# EasyEDA Pro project lune-v6-rev3.2.eprj

# Schematic lune-v6-rev3.2-connectors
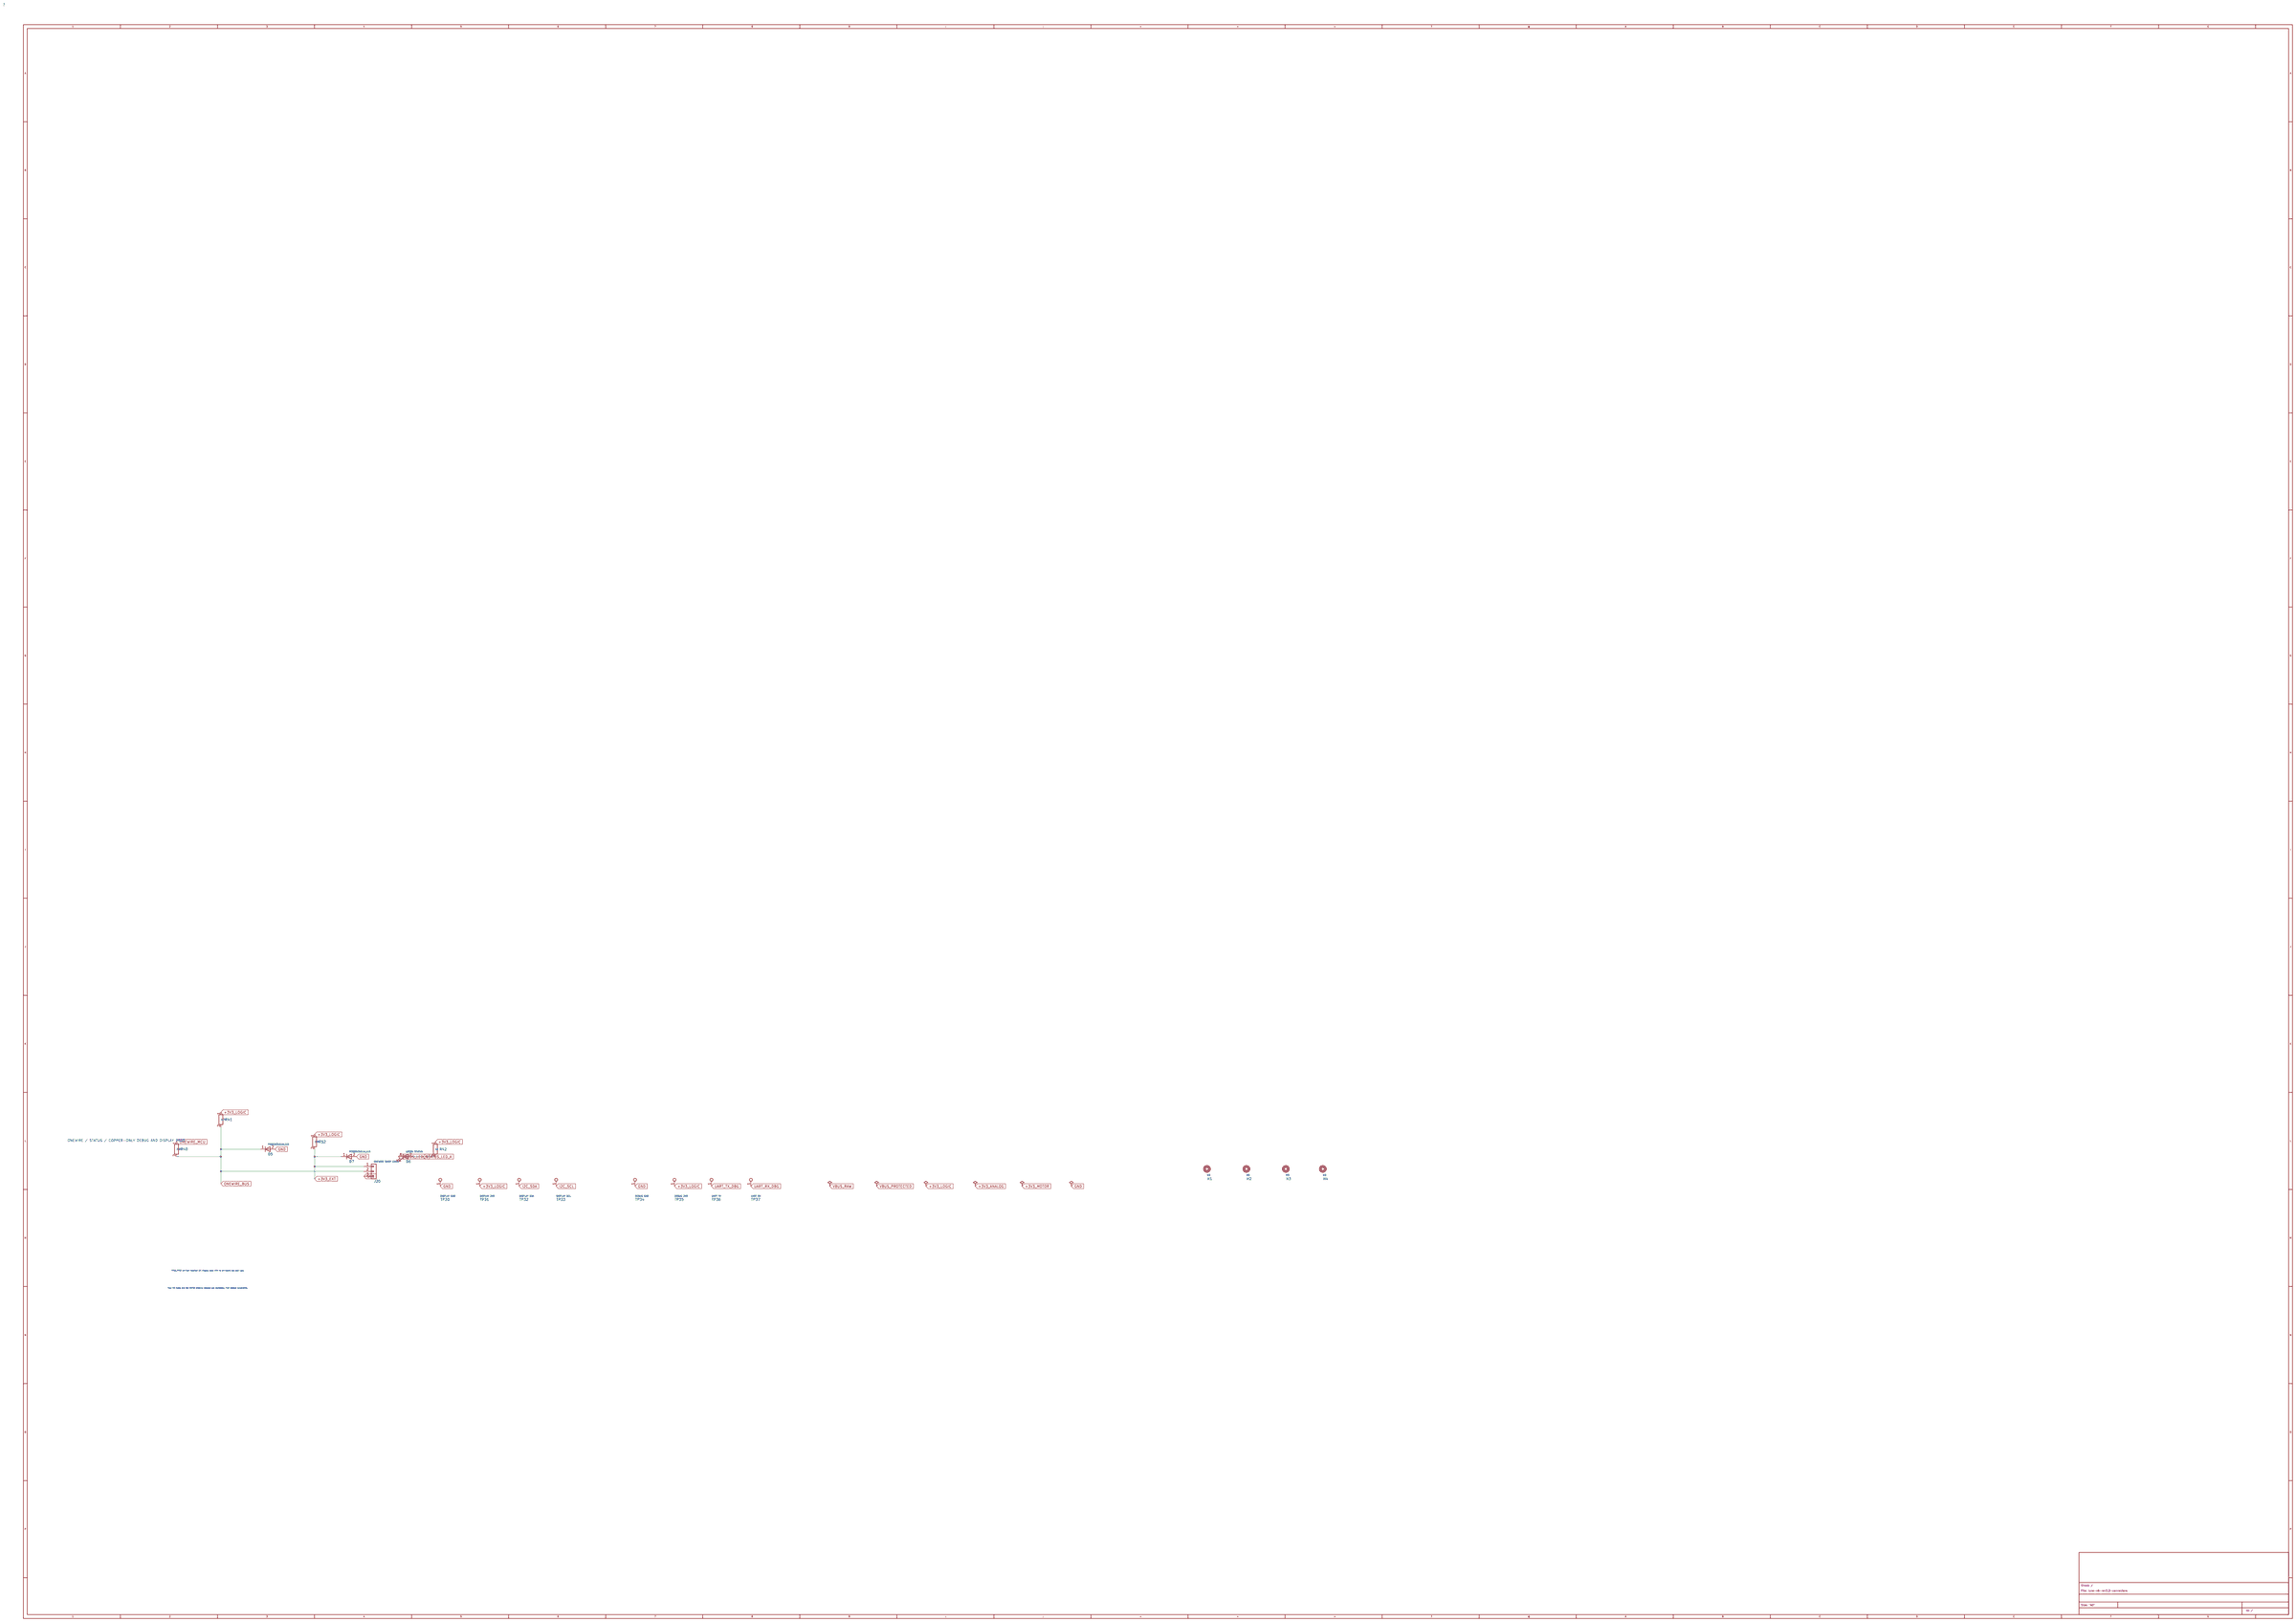
[diagram p0: schematic sheet]

## Parts
D5  PESD3V3U1UA,115
D6  GREEN STATUS
D7  PESD3V3U1UA,115
H1  M3
H2  M3
H3  M3
H4  M3
J20  ONEWIRE DAISY CHAIN
R40  33R
R41  4.7k
R42  1k
R52  33R
TP30  DISPLAY GND
TP31  DISPLAY 3V3
TP32  DISPLAY SDA
TP33  DISPLAY SCL
TP34  DEBUG GND
TP35  DEBUG 3V3
TP36  UART TX
TP37  UART RX

## Library data of the parts
D5 D7 = Device_D: LCSC: C403915
D6 = Device_LED: MPN: KT-0805G; LCSC: C2297
H1-H4 = Mechanical_MountingHole: Assembly: MECHANICAL_ONLY
J20 = Connector_Generic_Conn_01x03: MPN: DB301V-3.5-3P-GN-S; LCSC: C695630; Status: FROZEN
R40 R52 = Device_R: MPN: CRCW060333R0FKEA; LCSC: C844927
R41 = Device_R: MPN: RC0603FR-074K7L; LCSC: C99782
R42 = Device_R: MPN: RC0603FR-071KL; LCSC: C22548
TP30-TP37 = Connector_TestPoint: DNP: yes; Assembly: COPPER_ONLY

## Nets
+3V3_EXT: D7.1(K) J20.1(Pin) R52.2
I2C_SCL: TP33.1
I2C_SDA: TP32.1
ONEWIRE_BUS: D5.1(K) J20.2(Pin) R40.2 R41.2
ONEWIRE_MCU: R40.1
POWER_PWR_FLAG: D5.2(A) D7.2(A) J20.3(Pin) R41.1 R42.1 R52.1 TP30.1 TP31.1 TP34.1 TP35.1
STATUS_LED_A: D6.2(A) R42.2
STATUS_LED_N: D6.1(K)
UART_RX_DBG: TP37.1
UART_TX_DBG: TP36.1

## Notes on the sheet
- ONEWIRE / STATUS / COPPER-ONLY DEBUG AND DISPLAY PADS
- TP30..TP33 are four labelled I2C display pads with no on-board bus pull-ups.
- Four M3 holes and the ESP32 antenna keepout are mandatory PCB release constraints.

# Schematic lune-v6-rev3.2-analog
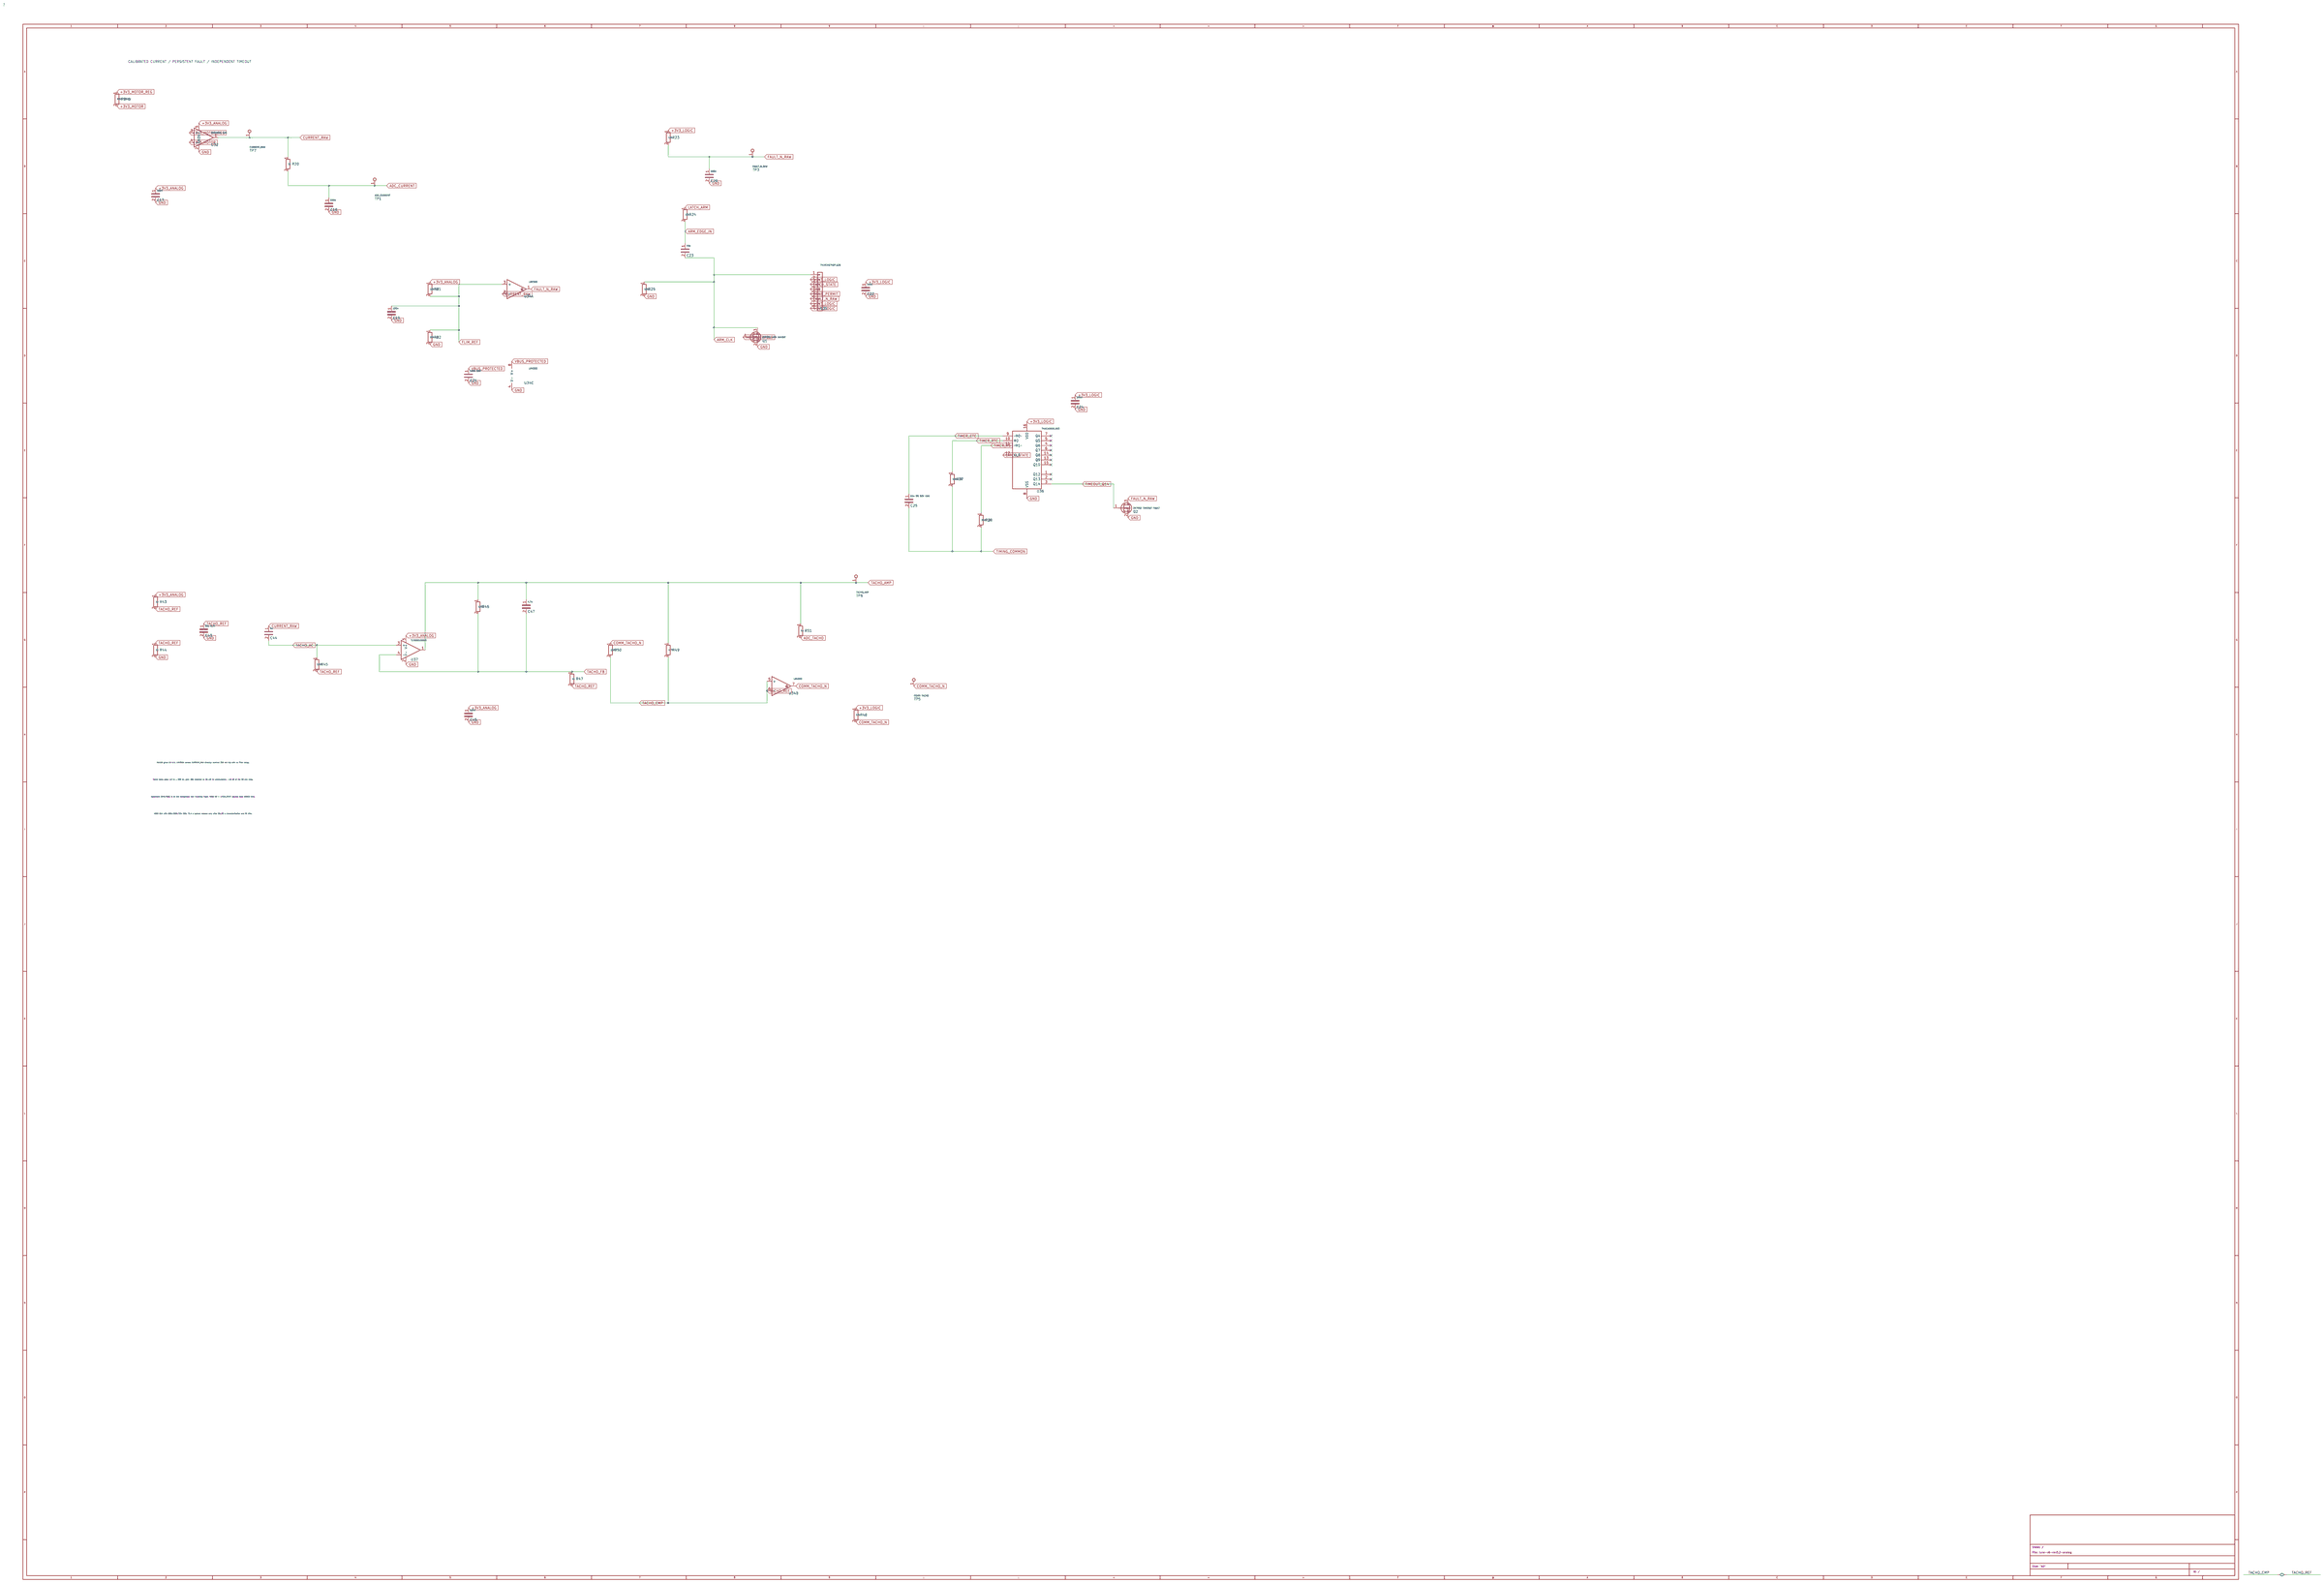
[diagram p1: schematic sheet]

## Parts
C17  100n
C18  100n
C19  100n
C20  100n
C21  100n 10V
C22  100n
C23  10n
C24  100n
C25  22n 5% 50V C0G
C43  22u 6.3V
C44  1u
C45  100n
C47  4.7n
Q1  2N7002 ARM INHIBIT
Q2  2N7002 TIMEOUT FAULT
R20  1k
R21  10k 1%
R22  56k 1%
R23  10k
R24  10k
R25  100k
R27  180k 1%
R28  360k 1%
R43  1k
R44  1k
R45  100k
R46  100k
R47  1k
R48  10k
R49  4.7k
R50  100k
R51  1k
RSH1  0.5R 1% 1W
TP1  ADC_CURRENT
TP3  FAULT_N_RAW
TP5  COMM TACHO
TP6  TACHO_AMP
TP7  CURRENT_RAW
U32  INA180A1 x20
U34  LMV393  (sections 1,2,3)
U35  74LVC1G74DP,125
U36  74HC4060D,653
U37  TLV9001IDBVR

## Library data of the parts
C17-C22 C24 C45 = Device_C: LCSC: C14663; MPN: CC0603KRX7R9BB104; DNP: yes
C23 = Device_C: LCSC: C1589; MPN: CL10B103KB8NNNC; DNP: yes
C25 = Device_C: Status: CHARACTERIZE_AND_TRIM_RT; Dielectric: C0G_NP0_MANDATORY; Sourcing: OPEN_VERIFY_LCSC_22N_5PCT_50V_C0G_1206
C43 = Device_C: MPN: TCC0805X5R226K6R3FT; LCSC: C380337
C44 = Device_C: LCSC: C108463; MPN: 0603B105K160CT; DNP: yes
C47 = Device_C: LCSC: C106218; MPN: CC0603KRX7R9BB472; DNP: yes
Q1 Q2 = Transistor_FET_2N7002: MPN: 2N7002; LCSC: C8545
R20 R43 R44 R47 R51 = Device_R: MPN: RC0603FR-071KL; LCSC: C22548
R21 R23 R24 R48 = Device_R: MPN: RC0603FR-0710KL; LCSC: C98220
R22 = Device_R: MPN: RC0603FR-0756KL; LCSC: C114630
R25 R45 R46 R50 = Device_R: MPN: RC0603FR-07100KL; LCSC: C14675
R27 = Device_R: MPN: RC0603FR-07180KL; LCSC: C123419
R28 = Device_R: MPN: RC0603FR-07360KL; LCSC: C137740
R49 = Device_R: MPN: RC0603FR-074K7L; LCSC: C99782
RSH1 = Device_R: MPN: HoYH1206-1W-500mR-1%; LCSC: C601092; Status: PRODUCTION_TUNING_PARAMETER; Layout: KELVIN_PAIR_REQUIRED
TP1 TP3 TP5-TP7 = Connector_TestPoint: DNP: yes; Assembly: COPPER_ONLY
U32 = Amplifier_Current_INA180A1: MPN: INA180A1IDBVR; LCSC: C122228
U34 = Comparator_LMV393: MPN: LMV393IDR; LCSC: C7984
U35 = Connector_Generic_Conn_01x08: LCSC: C458768; Pinout: 1 CP; 2 D; 3 /Q; 4 GND; 5 Q; 6 /RD; 7 /SD; 8 VCC
U36 = 74xx_74HC4060: LCSC: C5649
U37 = Amplifier_Operational_OPA310xDBV: LCSC: C398363; Symbol_Carrier: OPA310xDBV_CHOSEN_FOR_TLV9001_DBV_PINOUT

## Nets
+3V3_ANALOG: C17.1 C45.1 R21.1 R43.1 U32.5(V+) U37.5(V+)
+3V3_LOGIC: C22.1 C24.1 R23.1 R48.1 U35.2(Pin) U35.7(Pin) U35.8(Pin) U36.16(VDD)
+3V3_MOTOR: RSH1.2 U32.4(-)
+3V3_MOTOR_REG: RSH1.1 U32.3(+)
GND: C17.2 C18.2 C19.2 C20.2 C21.2 C22.2 C24.2 C43.2 C45.2 Q1.2(S) Q2.2(S) R22.2 R25.2 R44.2 U32.2(GND) U34.4(V-) U35.4(Pin) U36.8(VSS) U37.2(V-)
VBUS_PROTECTED: C21.1 U34.8(V+)
ADC_CURRENT: C18.1 R20.2 TP1.1
ADC_TACHO: R51.2
ARM_CLK: C23.2 Q1.3(D) R25.1 U35.1(Pin)
ARM_EDGE_IN: C23.1 R24.2
COMM_TACHO_N: R48.2 R50.1 TP5.1 U34.7
CURRENT_RAW: C44.1 R20.1 TP7.1 U32.1 U34.2(-)
DRIVE_PERMIT: U35.5(Pin)
FAULT_N_RAW: C20.1 Q2.3(D) R23.2 TP3.1 U34.1 U35.6(Pin)
FLIM_REF: C19.1 R21.2 R22.1 U34.3(+)
LATCH_ARM: R24.1
LATCH_STATE: U35.3(Pin) U36.12(CLR)
MOTOR_ENABLE: Q1.1(G)
TACHO_AC: C44.2 R45.1 U37.3(+)
TACHO_AMP: C47.1 R46.1 R49.1 R51.1 TP6.1 U37.1
TACHO_CMP: C43.1 R43.2 R44.1 R45.2 R47.2 R49.2 R50.2 U34.5(+) U34.6(-)
TACHO_FB: C47.2 R46.2 R47.1 U37.4(-)
TIMEOUT_Q14: Q2.1(G) U36.3(Q14)
TIMER_CTC: C25.1 U36.9(~Φ0~)
TIMER_RS: R28.1 U36.11(~Φ1~)
TIMER_RTC: R27.1 U36.10(Φ0)
TIMING_COMMON: C25.2 R27.2 R28.2

Not connected (* = marked no-connect by the designer): U36 1(Q12)* 2(Q13)* 4(Q6)* 5(Q5)* 6(Q7)* 7(Q4)* 13(Q9)* 14(Q8)* 15(Q10)*

## Notes on the sheet
- CALIBRATED CURRENT / PERSISTENT FAULT / INDEPENDENT TIMEOUT
- INA180 gives 10 V/A. LMV393A senses CURRENT_RAW directly: nominal 280 mA trip with no filter delay.
- Tacho band-pass 1.6 Hz .. 339 Hz, gain ~85: matched to 20-40 Hz commutation, -43 dB at the 50 kHz chop.
- Hysteresis (R49/R50) is on the comparator non-inverting input. 4060 MR = LATCH_STATE bounds total ARMED time.
- 4060 Q14 with 180k/360k/22n C0G: 71.4 s typical; release only after 50..90 s characterization and Rt trim.

# Schematic lune-v6-rev3.2-motors
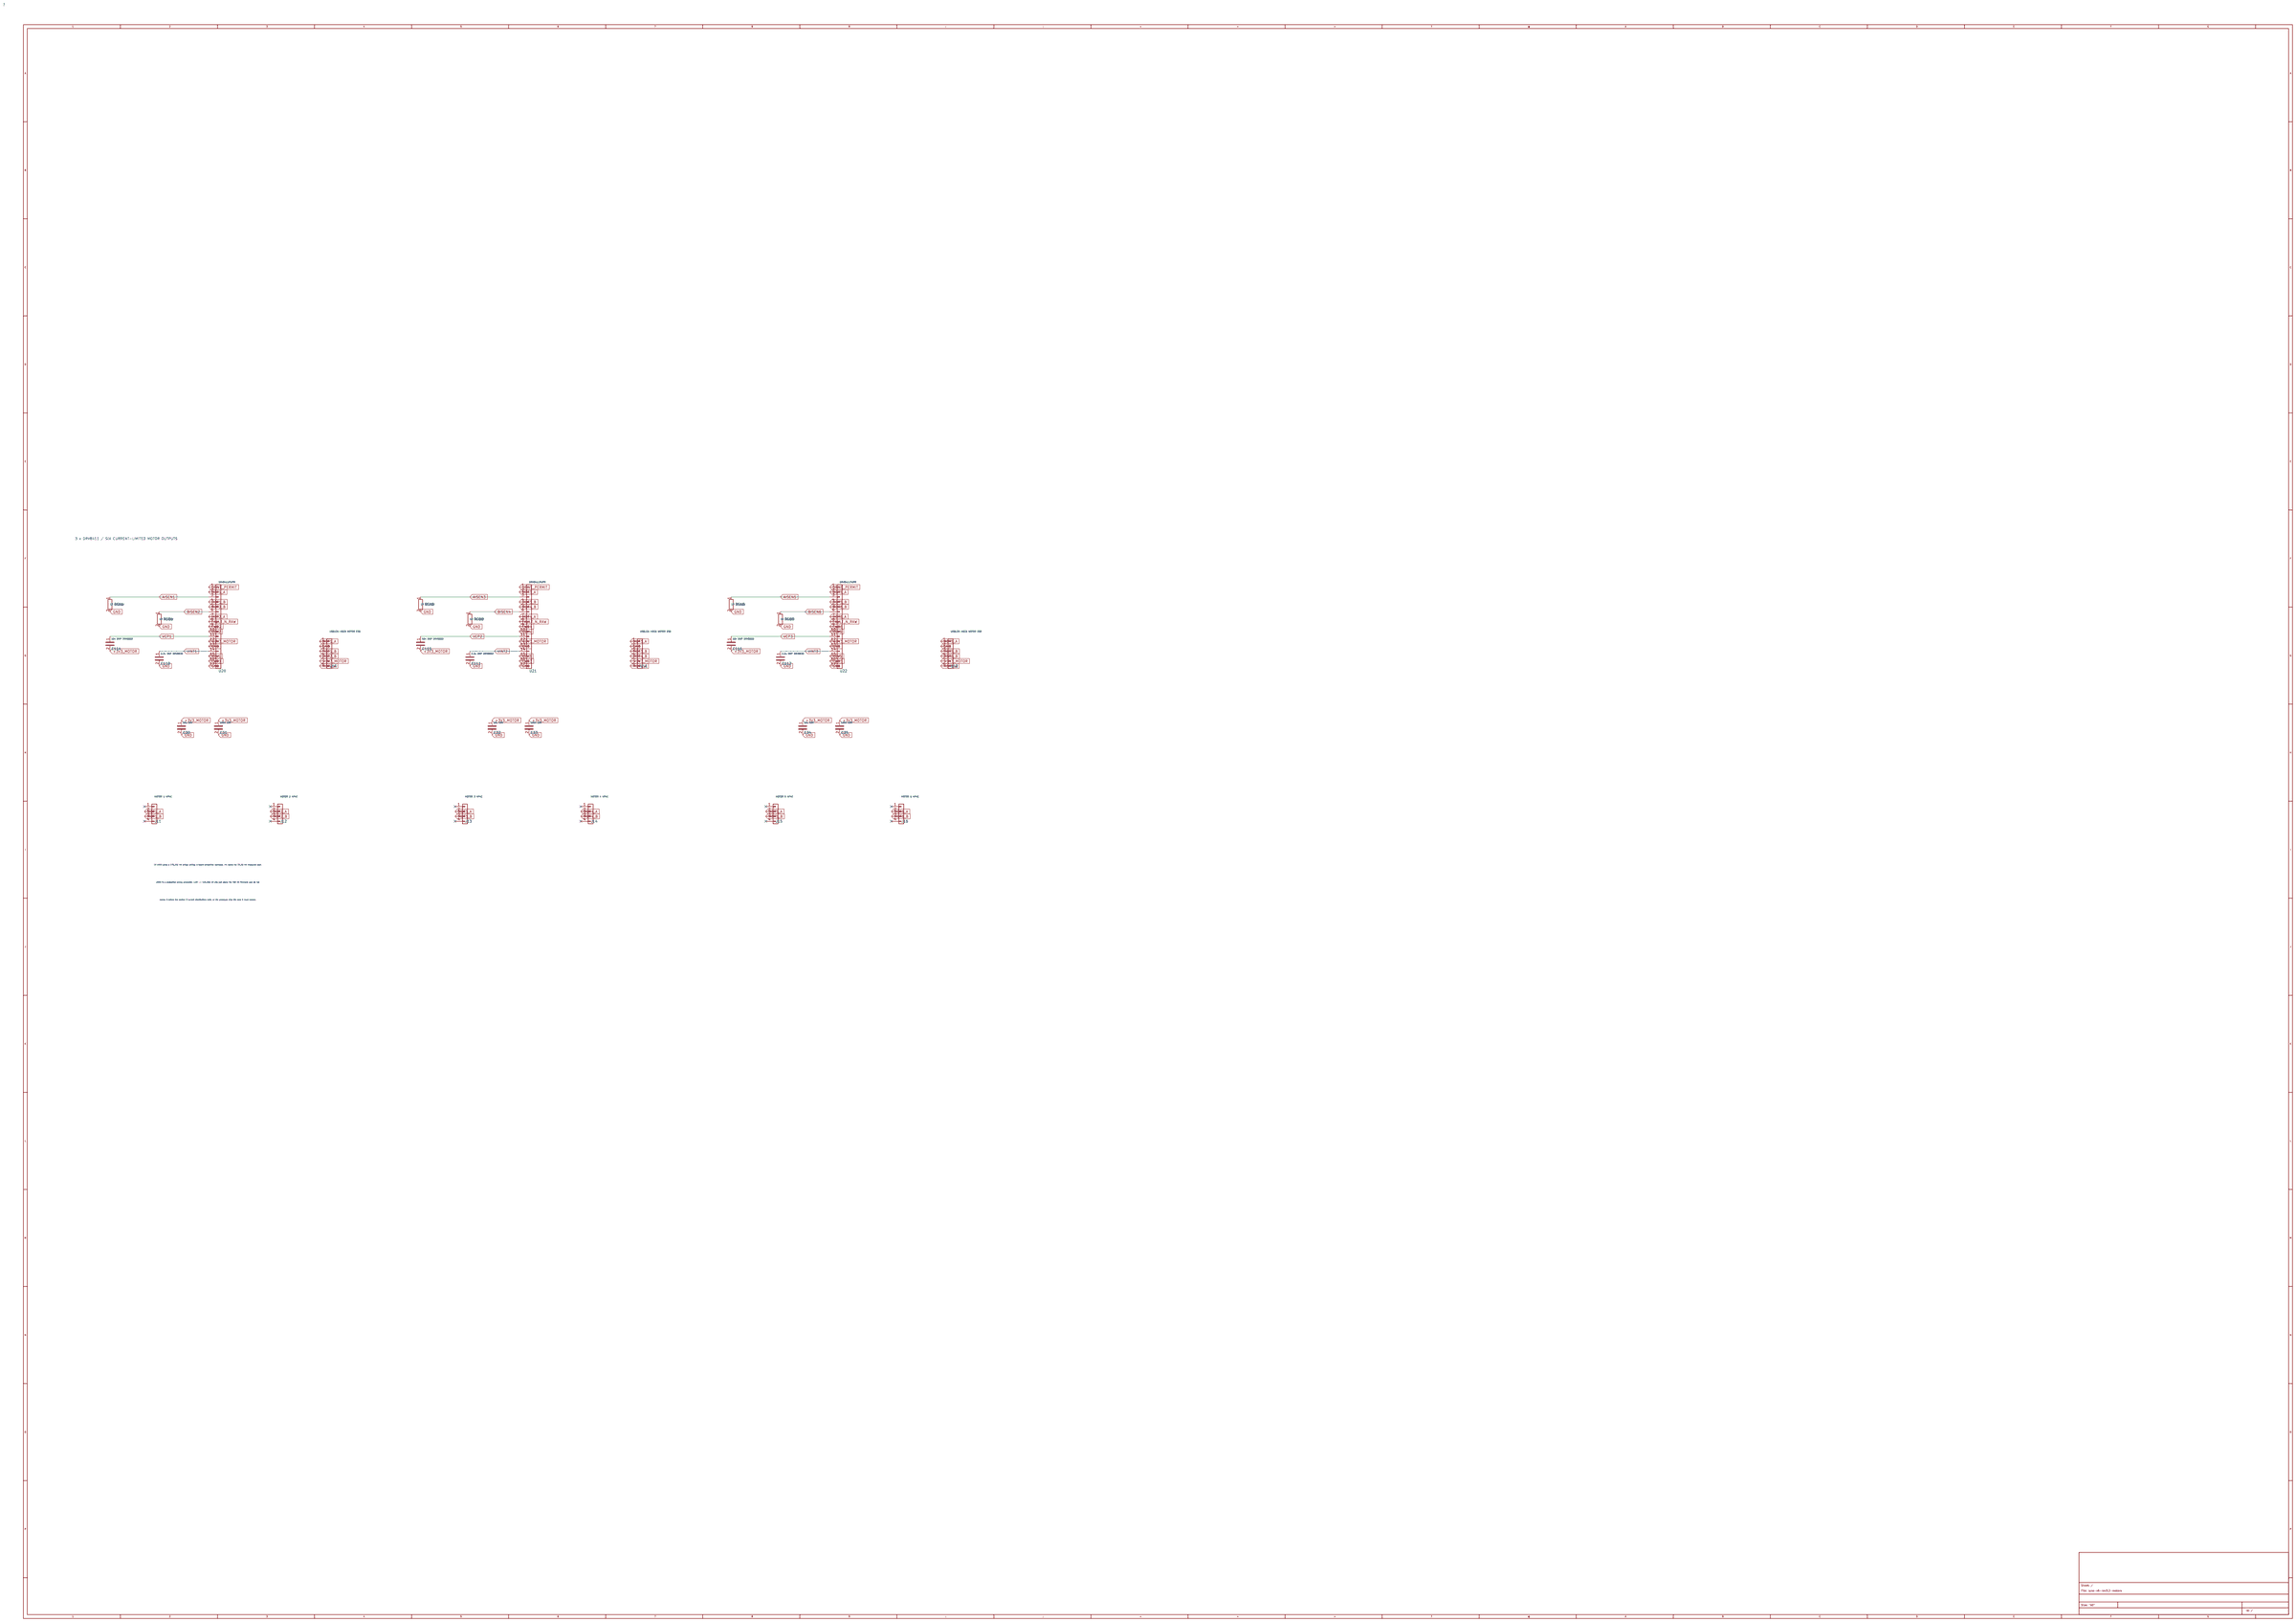
[diagram p2: schematic sheet]

## Parts
C30  10u 10V
C31  100n 10V
C32  10u 10V
C33  100n 10V
C34  10u 10V
C35  100n 10V
C110  2.2u DNP DRV8833
C111  2.2u DNP DRV8833
C112  2.2u DNP DRV8833
C114  10n DNP DRV8833
C115  10n DNP DRV8833
C116  10n DNP DRV8833
J11  MOTOR 1 4P4C
J12  MOTOR 2 4P4C
J13  MOTOR 3 4P4C
J14  MOTOR 4 4P4C
J15  MOTOR 5 4P4C
J16  MOTOR 6 4P4C
RSA1  1R 1% 0.5W
RSA2  1R 1% 0.5W
RSA3  1R 1% 0.5W
RSB1  1R 1% 0.5W
RSB2  1R 1% 0.5W
RSB3  1R 1% 0.5W
U20  DRV8411PWPR
U21  DRV8411PWPR
U22  DRV8411PWPR
U40  USBLC6-4SC6 MOTOR ESD
U41  USBLC6-4SC6 MOTOR ESD
U42  USBLC6-4SC6 MOTOR ESD

## Library data of the parts
C30 C32 C34 = Device_C: MPN: TCC0805X7R106K100FT; LCSC: C380346
C31 C33 C35 C110-C112 C114-C116 = Device_C: LCSC: C14663; MPN: CC0603KRX7R9BB104; DNP: yes
J11-J16 = Connector_Generic_Conn_01x04: MPN: 5301-4P4C; LCSC: C3097715
RSA1-RSA3 RSB1-RSB3 = Device_R: MPN: CSR1206FK1R00; LCSC: C346773; Status: PRODUCTION_TUNING_PARAMETER; Layout: KELVIN_PAIR_REQUIRED
U20-U22 = Connector_Generic_Conn_01x17: LCSC: C18212622; Alternate_MPN: DRV8833PWPR; Alternate_LCSC: C50506; Alternate_Status: SECOND_SOURCE_ONLY_SEE_ARCHITECTURE_MD; Pinout: 1 nSLEEP; 2 AOUT1; 3 AISEN; 4 AOUT2; 5 BOUT2; 6 BISEN; 7 BOUT1; 8 nFAULT; 9 BIN1; 10 BIN2; 11 NC/VCP fallback; 12 VM; 13 GND; 14 NC/VINT fallback; 15 AIN2; 16 AIN1; 17 EP
U40-U42 = Connector_Generic_Conn_01x06: MPN: USBLC6-4SC6; LCSC: C111212; Pinout: 1 I/O1; 2 GND; 3 I/O2; 4 I/O3; 5 VBUS; 6 I/O4

## Nets
+3V3_MOTOR: C30.1 C31.1 C32.1 C33.1 C34.1 C35.1 C114.2 C115.2 C116.2 U20.12(Pin) U21.12(Pin) U22.12(Pin) U40.5(Pin) U41.5(Pin) U42.5(Pin)
GND: C30.2 C31.2 C32.2 C33.2 C34.2 C35.2 C110.2 C111.2 C112.2 RSA1.2 RSA2.2 RSA3.2 RSB1.2 RSB2.2 RSB3.2 U20.13(Pin) U20.17(Pin) U21.13(Pin) U21.17(Pin) U22.13(Pin) U22.17(Pin) U40.2(Pin) U41.2(Pin) U42.2(Pin)
VINT1: C110.1 U20.14(Pin)
VINT2: C111.1 U21.14(Pin)
VINT3: C112.1 U22.14(Pin)
AISEN1: RSA1.1 U20.3(Pin)
AISEN3: RSA2.1 U21.3(Pin)
AISEN5: RSA3.1 U22.3(Pin)
BISEN2: RSB1.1 U20.6(Pin)
BISEN4: RSB2.1 U21.6(Pin)
BISEN6: RSB3.1 U22.6(Pin)
DRIVE_PERMIT: U20.1(Pin) U21.1(Pin) U22.1(Pin)
FAULT_N_RAW: U20.8(Pin) U21.8(Pin) U22.8(Pin)
FWD1: U20.16(Pin)
FWD2: U20.9(Pin)
FWD3: U21.16(Pin)
FWD4: U21.9(Pin)
FWD5: U22.16(Pin)
FWD6: U22.9(Pin)
MOT1_A: J11.2(Pin) U20.2(Pin) U40.1(Pin)
MOT1_B: J11.3(Pin) U20.4(Pin) U40.3(Pin)
MOT2_A: J12.2(Pin) U20.7(Pin) U40.6(Pin)
MOT2_B: J12.3(Pin) U20.5(Pin) U40.4(Pin)
MOT3_A: J13.2(Pin) U21.2(Pin) U41.1(Pin)
MOT3_B: J13.3(Pin) U21.4(Pin) U41.3(Pin)
MOT4_A: J14.2(Pin) U21.7(Pin) U41.6(Pin)
MOT4_B: J14.3(Pin) U21.5(Pin) U41.4(Pin)
MOT5_A: J15.2(Pin) U22.2(Pin) U42.1(Pin)
MOT5_B: J15.3(Pin) U22.4(Pin) U42.3(Pin)
MOT6_A: J16.2(Pin) U22.7(Pin) U42.6(Pin)
MOT6_B: J16.3(Pin) U22.5(Pin) U42.4(Pin)
REV1: U20.15(Pin)
REV2: U20.10(Pin)
REV3: U21.15(Pin)
REV4: U21.10(Pin)
REV5: U22.15(Pin)
REV6: U22.10(Pin)
VCP1: C114.1 U20.11(Pin)
VCP2: C115.1 U21.11(Pin)
VCP3: C116.1 U22.11(Pin)

Not connected (* = marked no-connect by the designer): J11 1(Pin)* 4(Pin)*; J12 1(Pin)* 4(Pin)*; J13 1(Pin)* 4(Pin)*; J14 1(Pin)* 4(Pin)*; J15 1(Pin)* 4(Pin)*; J16 1(Pin)* 4(Pin)*

## Notes on the sheet
- 3 x DRV8411 / SIX CURRENT-LIMITED MOTOR OUTPUTS
- 1R xISEN gives a 178..232 mA bridge ceiling: a board-protection backstop, ~4x above the 23..50 mA measured stall.
- xISEN is a production tuning parameter. 1.5R -> 119..155 mA sits just above the 100 mA firmware cap; do not
- narrow it before the section 3 current distributions exist, or the prototype clips the data it must collect.

# Schematic lune-v6-rev3.2-power
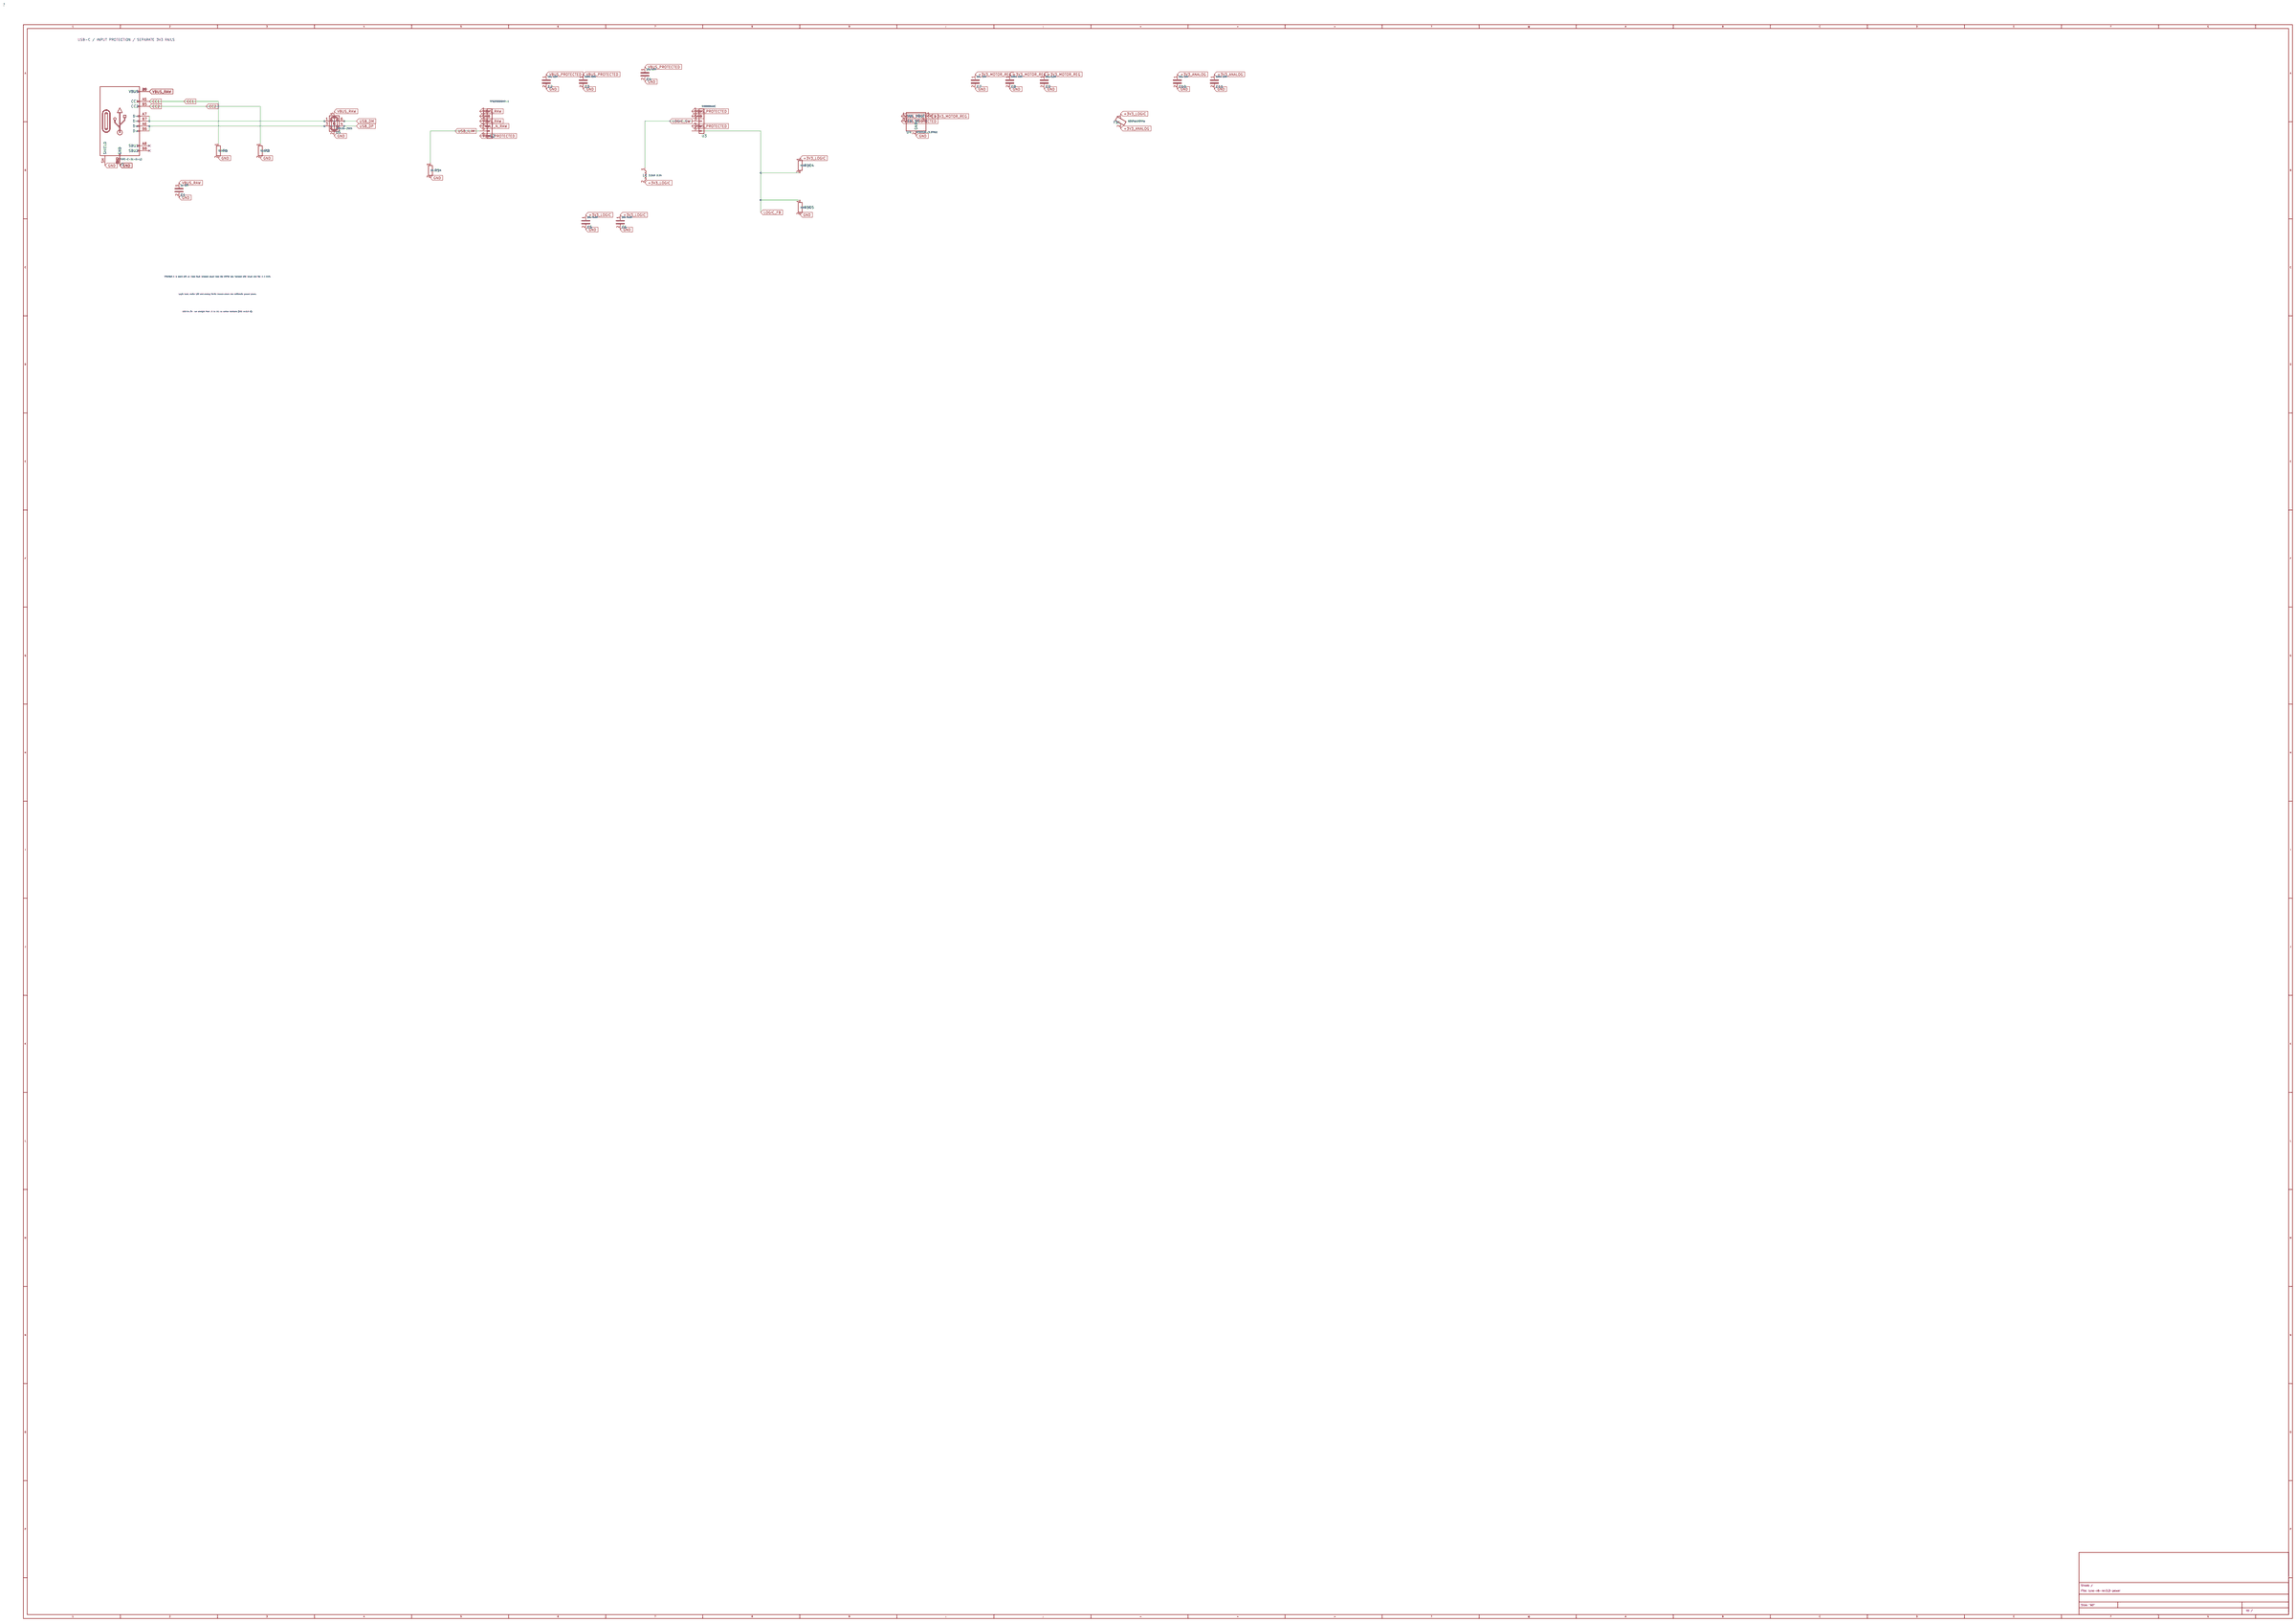
[diagram p3: schematic sheet]

## Parts
C1  1u 10V
C2  10u 10V
C3  100n 10V
C4  10u 10V
C5  22u 6.3V
C6  22u 6.3V
C7  10u 10V
C8  100n 10V
C9  22u 6.3V
C10  10u 10V
C11  100n 10V
FB1  600R@100MHz
J1  TYPE-C-31-M-12
L1  2.2uH 2.2A
R1  5.1k 1%
R2  5.1k 1%
R5  23.7k 1%
R104  453k 1%
R105  100k 1%
U2  TPS2553DBVR-1
U3  SY8089AAAC
U4  AP2112K-3.3TRG1
U5  USBLC6-2SC6

## Library data of the parts
C1 = Device_C: LCSC: C108463; MPN: 0603B105K160CT; DNP: yes
C2 C4 C7 C10 = Device_C: MPN: TCC0805X7R106K100FT; LCSC: C380346
C3 C8 C11 = Device_C: LCSC: C14663; MPN: CC0603KRX7R9BB104; DNP: yes
C5 C6 C9 = Device_C: MPN: TCC0805X5R226K6R3FT; LCSC: C380337
FB1 = Device_FerriteBead: MPN: GZ1608D601TF; LCSC: C1002
J1 = Connector_USB_C_Receptacle_USB2.0_16P: LCSC: C165948
L1 = Device_L: MPN: SPH4018H2R2MT; LCSC: C370436
R1 R2 = Device_R: MPN: 0603WAF5101T5E; LCSC: C23186
R5 = Device_R: MPN: RC0603FR-0723K7L; LCSC: C165751
R104 = Device_R: MPN: RC0603FR-07453KL; LCSC: C273765
R105 = Device_R: MPN: RC0603FR-07100KL; LCSC: C14675
U2 = Connector_Generic_Conn_01x06: LCSC: C111738; Pinout: 1 IN; 2 GND; 3 EN; 4 nFAULT; 5 ILIM; 6 OUT
U3 = Connector_Generic_Conn_01x05: LCSC: C78988; Pinout: 1 EN; 2 GND; 3 LX; 4 IN; 5 FB
U4 = Regulator_Linear_AP2112K-3.3: LCSC: C51118
U5 = Power_Protection_USBLC6-2SC6: LCSC: C7519

## Nets
+3V3_ANALOG: C10.1 C11.1 FB1.2
+3V3_LOGIC: C5.1 C6.1 FB1.1 L1.2 R104.1
+3V3_MOTOR_REG: C7.1 C8.1 C9.1 U4.5(VOUT)
GND: C1.2 C2.2 C3.2 C4.2 C5.2 C6.2 C7.2 C8.2 C9.2 C10.2 C11.2 J1.A1(GND) J1.A12(GND) J1.B1(GND) J1.B12(GND) J1.SH(SHIELD) R1.2 R2.2 R5.2 R105.2 U2.2(Pin) U3.2(Pin) U4.2(GND) U5.2(GND)
VBUS_PROTECTED: C2.1 C3.1 C4.1 U2.6(Pin) U3.1(Pin) U3.4(Pin) U4.1(VIN) U4.3(EN)
VBUS_RAW: C1.1 J1.A4(VBUS) J1.A9(VBUS) J1.B4(VBUS) J1.B9(VBUS) U2.1(Pin) U2.3(Pin) U5.5(VBUS)
CC1: J1.A5(CC1) R1.1
CC2: J1.B5(CC2) R2.1
FAULT_N_RAW: U2.4(Pin)
LOGIC_FB: R104.2 R105.1 U3.5(Pin)
LOGIC_SW: L1.1 U3.3(Pin)
USB_DM: J1.A7(D-) J1.B7(D-) U5.1(I/O1) U5.6(I/O1)
USB_DP: J1.A6(D+) J1.B6(D+) U5.3(I/O2) U5.4(I/O2)
USB_ILIM: R5.1 U2.5(Pin)

Not connected (* = marked no-connect by the designer): J1 A8(SBU1)* B8(SBU2)*; U4 4(NC)*

## Notes on the sheet
- USB-C / INPUT PROTECTION / SEPARATE 3V3 RAILS
- TPS2553-1 is latch-off: an input fault removes power from the ESP32 too. Validate USB inrush and the ~1 A limit.
- Logic buck, motor LDO and analog ferrite branch share one deliberate ground plane.
- USB D+/D- run straight from J1 to U1; no series resistors (ECO rev3.2-B).

# Schematic lune-v6-rev3.2-controller
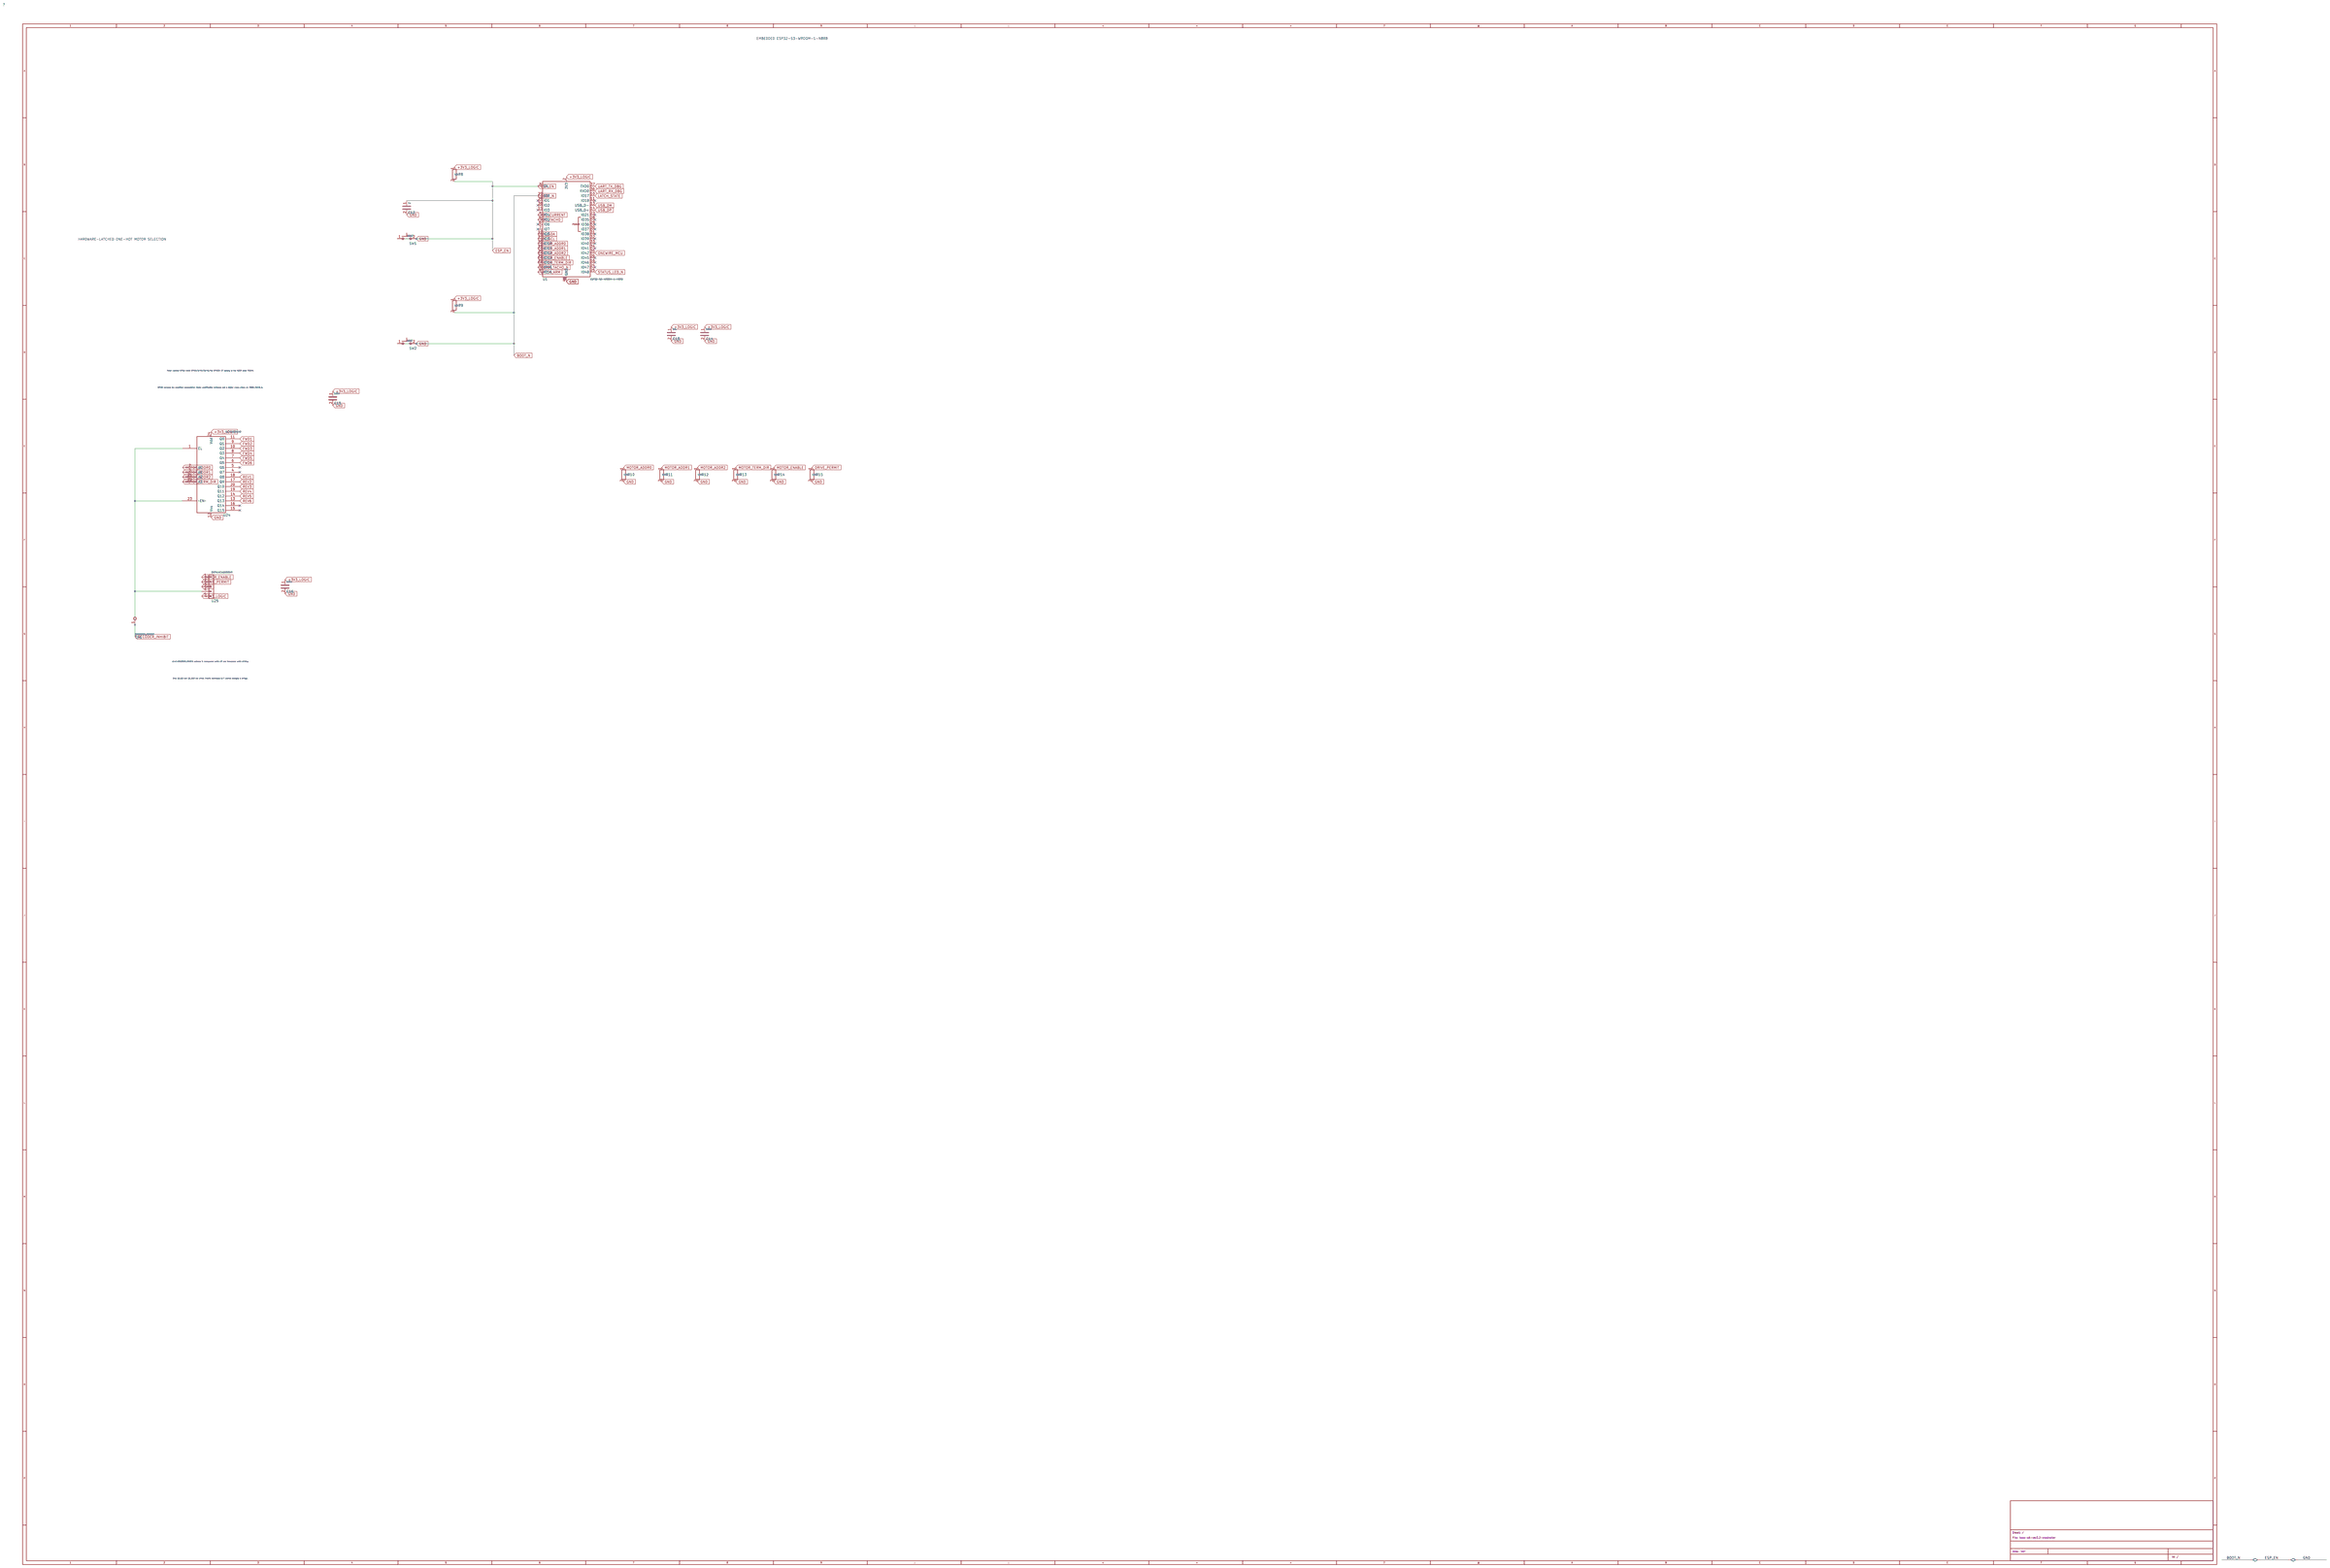
[diagram p4: schematic sheet]

## Parts
C12  1u
C13  10u
C14  100n
C15  100n
C16  100n
R8  10k
R9  10k
R10  100k
R11  100k
R12  100k
R13  100k
R14  100k
R15  100k
SW1  RESET
SW2  BOOT
TP4  DECODER_INHIBIT
U1  ESP32-S3-WROOM-1-N8R8
U24  XL74HC4514D
U25  SN74LVC1G00DBVR

## Library data of the parts
C12 = Device_C: LCSC: C108463; MPN: 0603B105K160CT; DNP: yes
C13 = Device_C: MPN: TCC0805X7R106K100FT; LCSC: C380346
C14-C16 = Device_C: LCSC: C14663; MPN: CC0603KRX7R9BB104; DNP: yes
R8 R9 = Device_R: MPN: RC0603FR-0710KL; LCSC: C98220
R10-R15 = Device_R: MPN: RC0603FR-07100KL; LCSC: C14675
SW1 SW2 = Switch_SW_Push: MPN: PTS810SJG250SMTRLFS; LCSC: C221895
TP4 = Connector_TestPoint: DNP: yes; Assembly: COPPER_ONLY
U1 = RF_Module_ESP32-S3-WROOM-1: LCSC: C2913201
U24 = 4xxx_IEEE_4514: LCSC: C50202050
U25 = Connector_Generic_Conn_01x05: LCSC: C7826; Pinout: 1 A; 2 B; 3 GND; 4 Y; 5 VCC

## Nets
+3V3_LOGIC: C13.1 C14.1 C15.1 C16.1 R8.1 R9.1 U1.2(3V3) U24.24(Vdd) U25.5(Pin)
ADC_CURRENT: U1.4(IO4)
ADC_TACHO: U1.5(IO5)
BOOT_N: C12.1 C12.2 C13.2 C14.2 C15.2 C16.2 R8.2 R9.2 R10.2 R11.2 R12.2 R13.2 R14.2 R15.2 SW1.1 SW1.2 SW2.1 SW2.2 U1.1(GND) U1.3(EN) U1.27(IO0) U1.40(GND) U1.41(GND) U24.12(Vss) U25.3(Pin)
COMM_TACHO_N: U1.8(IO15)
DECODER_INHIBIT: TP4.1 U24.1(EL) U24.23(~EN~) U25.4(Pin)
DRIVE_PERMIT: R15.1 U25.2(Pin)
FWD1: U24.11(Q0)
FWD2: U24.9(Q1)
FWD3: U24.10(Q2)
FWD4: U24.8(Q3)
FWD5: U24.7(Q4)
FWD6: U24.6(Q5)
I2C_SCL: U1.17(IO9)
I2C_SDA: U1.12(IO8)
LATCH_ARM: U1.9(IO16)
LATCH_STATE: U1.10(IO17)
MOTOR_ADDR0: R10.1 U1.18(IO10) U24.2(A0)
MOTOR_ADDR1: R11.1 U1.19(IO11) U24.3(A1)
MOTOR_ADDR2: R12.1 U1.20(IO12) U24.21(A2)
MOTOR_ENABLE: R14.1 U1.21(IO13) U25.1(Pin)
MOTOR_TERM_DIR: R13.1 U1.22(IO14) U24.22(A3)
ONEWIRE_MCU: U1.35(IO42)
REV1: U24.18(Q8)
REV2: U24.17(Q9)
REV3: U24.20(Q10)
REV4: U24.19(Q11)
REV5: U24.14(Q12)
REV6: U24.13(Q13)
STATUS_LED_N: U1.25(IO48)
UART_RX_DBG: U1.36(RXD0)
UART_TX_DBG: U1.37(TXD0)
USB_DM: U1.13(USB_D-)
USB_DP: U1.14(USB_D+)

Not connected (* = marked no-connect by the designer): U1 6(IO6)* 7(IO7)* 11(IO18)* 15(IO3)* 16(IO46)* 23(IO21)* 24(IO47)* 26(IO45)* 28(IO35)* 29(IO36)* 30(IO37)* 31(IO38)* 32(IO39)* 33(IO40)* 34(IO41)* 38(IO2)* 39(IO1)*; U24 4(Q7)* 5(Q6)* 15(Q15)* 16(Q14)*

## Notes on the sheet
- EMBEDDED ESP32-S3-WROOM-1-N8R8
- HARDWARE-LATCHED ONE-HOT MOTOR SELECTION
- Motor-control GPIOs avoid GPIO0/3/19/20/45/46; GPIO35-37 belong to the N8R8 octal PSRAM.
- GPIO5 samples the amplified commutation ripple: qualification evidence and a digital cross-check on COMM_TACHO_N.
- LE=E=DECODER_INHIBIT: address is transparent while off and immutable while driving.
- Only Q0..Q5 and Q8..Q13 are wired; invalid addresses 6/7 cannot energize a bridge.
